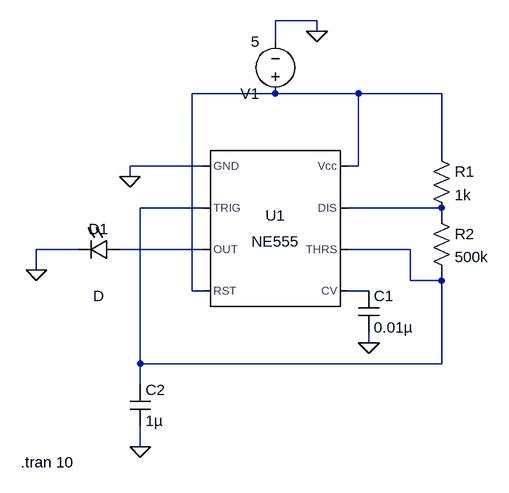
[diagram p0: schematic 555Timer.asc]
555Timer.asc, the LTspice schematic file:
Version 4
SHEET 1 880 680
WIRE -224 -128 -288 -128
WIRE -224 -112 -224 -128
WIRE -288 -96 -288 -128
WIRE -288 -16 -416 -16
WIRE -160 -16 -288 -16
WIRE -32 -16 -160 -16
WIRE -32 80 -32 -16
WIRE -400 96 -512 96
WIRE -160 96 -160 -16
WIRE -160 96 -176 96
WIRE -512 112 -512 96
WIRE -400 160 -496 160
WIRE -32 160 -176 160
WIRE -32 176 -32 160
WIRE -592 224 -656 224
WIRE -400 224 -528 224
WIRE -80 224 -176 224
WIRE -656 256 -656 224
WIRE -80 272 -80 224
WIRE -32 272 -32 256
WIRE -32 272 -80 272
WIRE -416 288 -416 -16
WIRE -400 288 -416 288
WIRE -144 288 -176 288
WIRE -144 368 -144 352
WIRE -496 400 -496 160
WIRE -32 400 -32 272
WIRE -32 400 -496 400
WIRE -496 432 -496 400
WIRE -496 528 -496 496
FLAG -144 368 0
FLAG -512 112 0
FLAG -496 528 0
FLAG -224 -112 0
FLAG -656 256 0
SYMBOL voltage -288 0 R180
WINDOW 123 0 0 Left 0
WINDOW 39 0 0 Left 0
SYMATTR InstName V1
SYMATTR Value 5
SYMBOL Misc\\NE555 -288 192 R0
SYMATTR InstName U1
SYMBOL res -48 64 R0
SYMATTR InstName R1
SYMATTR Value 1k
SYMATTR SpiceLine tol=5
SYMBOL res -48 160 R0
SYMATTR InstName R2
SYMATTR Value 500k
SYMATTR SpiceLine tol=5
SYMBOL cap -160 288 R0
SYMATTR InstName C1
SYMATTR Value 0.01µ
SYMBOL cap -512 432 R0
SYMATTR InstName C2
SYMATTR Value 1µ
SYMBOL LED -528 208 R90
WINDOW 0 0 32 VBottom 2
WINDOW 3 72 32 VTop 2
SYMATTR InstName D1
TEXT -680 552 Left 2 !.tran 10

The netlist it stands for:
* 555Timer.asc
V1 N001 0 5
XU1 0 N002 N004 N001 N005 N002 N003 N001 NE555  ; pins GND TRIG OUT RST CV THRS DIS Vcc
R1 N001 N003 1k tol=5
R2 N003 N002 500k tol=5
C1 N005 0 0.01µ
C2 N002 0 1µ
D1 N004 0 D
.model D D
.lib standard.dio
.tran 10
.lib NE555.sub
.backanno
.end